# Altium project Rys_PCB.PrjPcb
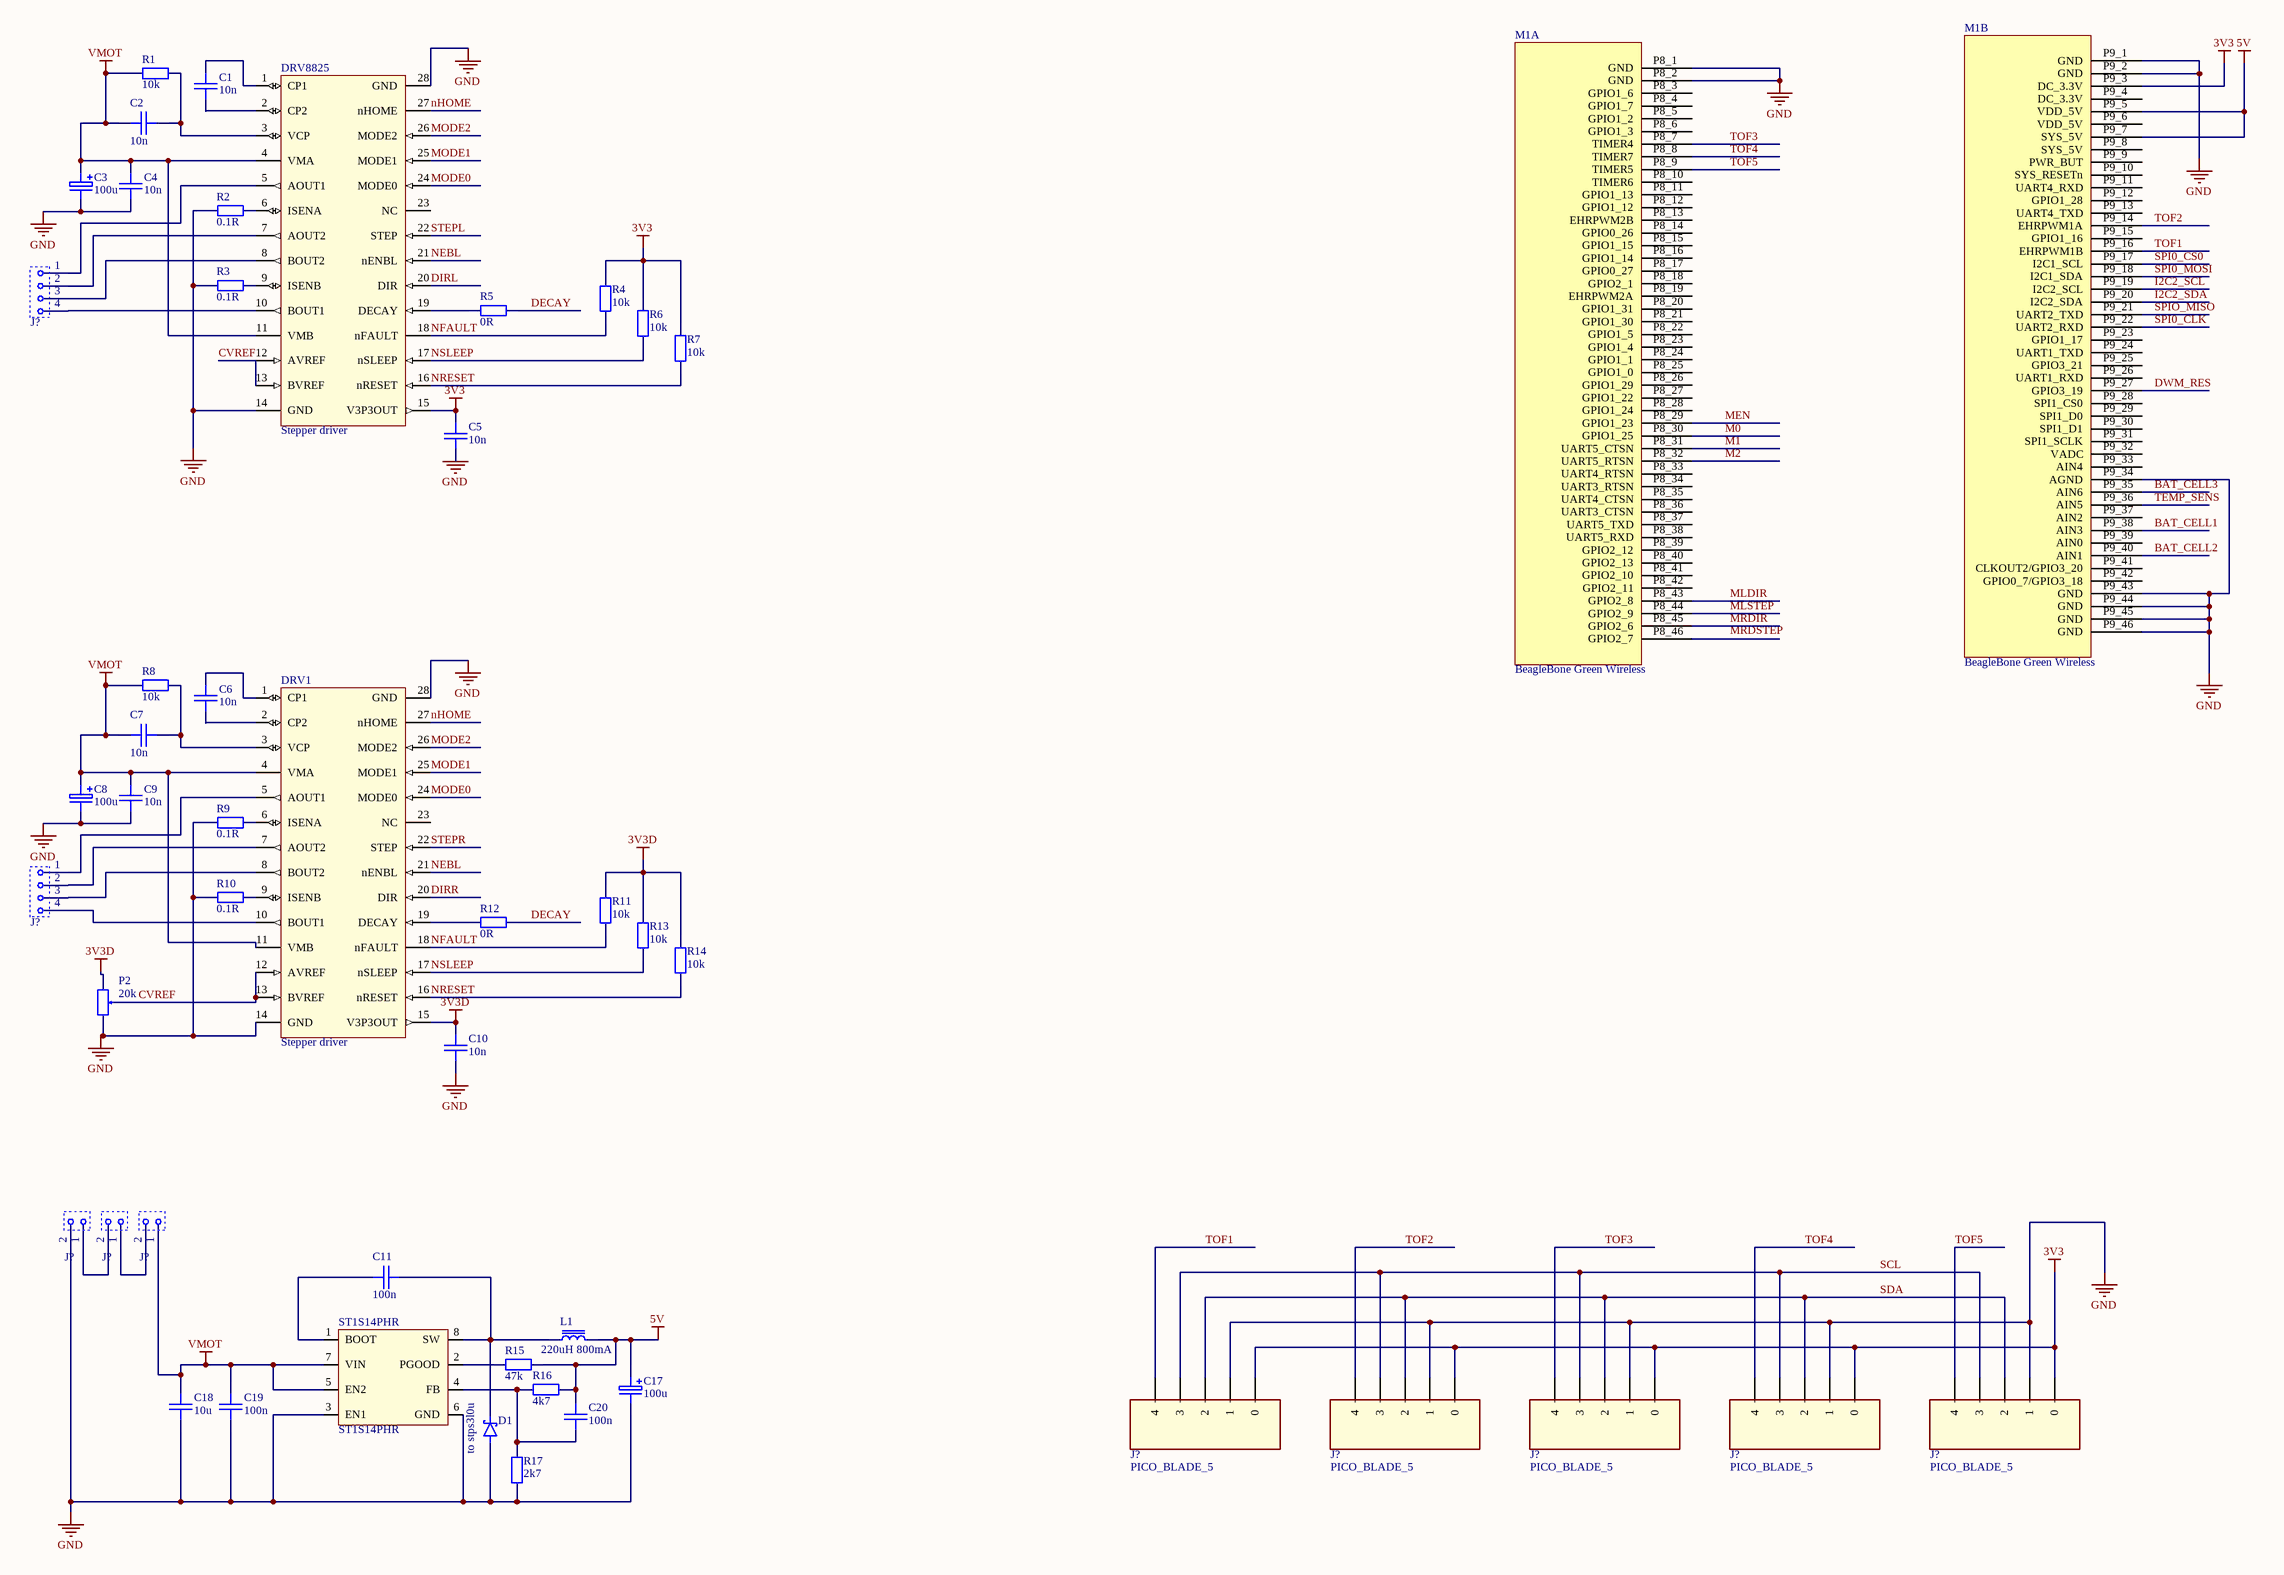
[diagram p0: rys_PCB.SchDoc]
1 sheet, 49 parts. Net scope: global (net labels, ports and power ports of the same name join across sheets).
Board file: rys_PCB.PcbDoc

## Sheet rys_PCB.SchDoc
size A2; Organization: Altium Limited; Address1: L3, 12a Rodborough Rd; Address2: Frenchs Forest; Address3: NSW; Address4: Australia 2086

### Parts
(Parts that share a designator on the sheet are numbered #1, #2 ... from top to bottom, then left to right.)
C1  10n  [0805]
C2  10n  [0805]
C3  100u  [_C_TAN_A]
C4  10n  [0805]
C5  10n  [0805]
C6  10n  [0805]
C7  10n  [0805]
C8  100u  [_C_TAN_A]
C9  10n  [0805]
C10  10n  [0805]
C11  100n  [0805]
C17  100u  [_C_TAN_A]
C18  10u  [0805]
C19  100n  [0805]
C20  100n  [0805]
D1  to stps3l0u  [SMB/DO-214AA]
DRV1  Stepper driver  [HTSSOP28]
DRV8825  Stepper driver  [HTSSOP28]
J?#1  Molex Microfit  [MICROFIT 4x1 Vertical]  (value not drawn)
J?#2  Molex Microfit  [MICROFIT 4x1 Vertical]  (value not drawn)
J?#3  Molex Microfit  [MICROFIT 1x2 Vertical]  (value not drawn)
J?#4  Molex Microfit  [MICROFIT 1x2 Vertical]  (value not drawn)
J?#5  Molex Microfit  [MICROFIT 1x2 Vertical]  (value not drawn)
J?#6  PICO_BLADE_5  [PicoBlade_THT_1x5_HEADER]
J?#7  PICO_BLADE_5  [PicoBlade_THT_1x5_HEADER]
J?#8  PICO_BLADE_5  [PicoBlade_THT_1x5_HEADER]
J?#9  PICO_BLADE_5  [PicoBlade_THT_1x5_HEADER]
J?#10  PICO_BLADE_5  [PicoBlade_THT_1x5_HEADER]
L1  220uH 800mA  [_L_DE1205]
M1  BeagleBone Green Wireless  [BeagleBone_Black]  (parts A,B of 2)
P2  20k  [_R_POTRM6H]
R1  10k  [0805_R]
R2  0.1R  [0805_R]
R3  0.1R  [0805_R]
R4  10k  [0805_R]
R5  0R  [0805_R]
R6  10k  [0805_R]
R7  10k  [0805_R]
R8  10k  [0805_R]
R9  0.1R  [0805_R]
R10  0.1R  [0805_R]
R11  10k  [0805_R]
R12  0R  [0805_R]
R13  10k  [0805_R]
R14  10k  [0805_R]
R15  47k  [0805_R]
R16  4k7  [0805_R]
R17  2k7  [0805_R]
ST1S14PHR  ST1S14PHR  [HSOP8]

### Nets
3V3: C5.1 DRV8825.15(V3P3OUT) J?#6.0 J?#7.0 J?#8.0 J?#9.0 J?#10.0 M1.P9_3(DC_3.3V) R4.2 R6.2 R7.2
3V3D: C10.1 DRV1.15(V3P3OUT) P2.3 R11.2 R13.2 R14.2
5V: C17.P C20.2 L1.1 M1.P9_5(VDD_5V) M1.P9_7(SYS_5V) R15.1 R16.1
GND: C3.N C4.2 C5.2 C8.N C9.2 C10.2 C17.N C18.1 C19.1 D1.A DRV1.14(GND) DRV1.28(GND) DRV8825.14(GND) DRV8825.28(GND) J?#3.2 J?#6.1 J?#7.1 J?#8.1 J?#9.1 J?#10.1 M1.P8_1(GND) M1.P8_2(GND) M1.P9_1(GND) M1.P9_2(GND) M1.P9_34(AGND) M1.P9_43(GND) M1.P9_44(GND) M1.P9_45(GND) M1.P9_46(GND) P2.1 R2.1 R3.1 R9.1 R10.1 R17.1 ST1S14PHR.3(EN1) ST1S14PHR.6(GND)
VMOT: C2.1 C3.P C4.1 C7.1 C8.P C9.1 C18.2 C19.2 DRV1.4(VMA) DRV1.11(VMB) DRV8825.4(VMA) DRV8825.11(VMB) J?#5.1 R1.1 R8.1 ST1S14PHR.5(EN2) ST1S14PHR.7(VIN)
BAT_CELL1: M1.P9_38(AIN3)
BAT_CELL2: M1.P9_40(AIN1)
BAT_CELL3: M1.P9_35(AIN6)
CVREF: DRV1.12(AVREF) DRV1.13(BVREF) DRV8825.12(AVREF) DRV8825.13(BVREF) P2.2
DECAY: R5.1 R12.1
DIRL: DRV8825.20(DIR)
DIRR: DRV1.20(DIR)
DWM_RES: M1.P9_27(GPIO3_19)
I2C2_SCL: M1.P9_19(I2C2_SCL)
I2C2_SDA: M1.P9_20(I2C2_SDA)
M0: M1.P8_30(GPIO1_25)
M1: M1.P8_31(UART5_CTSN)
M2: M1.P8_32(UART5_RTSN)
MEN: M1.P8_29(GPIO1_23)
MLDIR: M1.P8_43(GPIO2_8)
MLSTEP: M1.P8_44(GPIO2_9)
MODE0: DRV1.24(MODE0) DRV8825.24(MODE0)
MODE1: DRV1.25(MODE1) DRV8825.25(MODE1)
MODE2: DRV1.26(MODE2) DRV8825.26(MODE2)
MRDIR: M1.P8_45(GPIO2_6)
NEBL: DRV1.21(nENBL) DRV8825.21(nENBL)
NFAULT: DRV1.18(nFAULT) DRV8825.18(nFAULT) R4.1 R11.1
nHOME: DRV1.27(nHOME) DRV8825.27(nHOME)
NRESET: DRV1.16(nRESET) DRV8825.16(nRESET) R7.1 R14.1
NSLEEP: DRV1.17(nSLEEP) DRV8825.17(nSLEEP) R6.1 R13.1
SCL: J?#6.3 J?#7.3 J?#8.3 J?#9.3 J?#10.3
SDA: J?#6.2 J?#7.2 J?#8.2 J?#9.2 J?#10.2
SPI0_CLK: M1.P9_22(UART2_RXD)
SPI0_CS0: M1.P9_17(I2C1_SCL)
SPI0_MOSI: M1.P9_18(I2C1_SDA)
SPIO_MISO: M1.P9_21(UART2_TXD)
STEPL: DRV8825.22(STEP)
STEPR: DRV1.22(STEP)
TEMP_SENS: M1.P9_36(AIN5)
TOF1: J?#6.4 M1.P9_16(EHRPWM1B)
TOF2: J?#7.4 M1.P9_14(EHRPWM1A)
TOF3: J?#8.4 M1.P8_7(TIMER4)
TOF4: J?#9.4 M1.P8_8(TIMER7)
TOF5: J?#10.4 M1.P8_9(TIMER5)
NetC1_1: C1.1 DRV8825.1(CP1)
NetC1_2: C1.2 DRV8825.2(CP2)
NetC2_2: C2.2 DRV8825.3(VCP) R1.2
NetC6_1: C6.1 DRV1.1(CP1)
NetC6_2: C6.2 DRV1.2(CP2)
NetC7_2: C7.2 DRV1.3(VCP) R8.2
NetC11_1: C11.1 ST1S14PHR.1(BOOT)
NetC11_2: C11.2 D1.K L1.2 ST1S14PHR.8(SW)
NetC20_1: C20.1 R16.2 R17.2 ST1S14PHR.4(FB)
NetDRV1_5: DRV1.5(AOUT1) J?#2.1
NetDRV1_6: DRV1.6(ISENA) R9.2
NetDRV1_7: DRV1.7(AOUT2) J?#2.2
NetDRV1_8: DRV1.8(BOUT2) J?#2.3
NetDRV1_9: DRV1.9(ISENB) R10.2
NetDRV1_10: DRV1.10(BOUT1) J?#2.4
NetDRV1_19: DRV1.19(DECAY) R12.2
NetDRV8825_5: DRV8825.5(AOUT1) J?#1.1
NetDRV8825_6: DRV8825.6(ISENA) R2.2
NetDRV8825_7: DRV8825.7(AOUT2) J?#1.2
NetDRV8825_8: DRV8825.8(BOUT2) J?#1.3
NetDRV8825_9: DRV8825.9(ISENB) R3.2
NetDRV8825_10: DRV8825.10(BOUT1) J?#1.4
NetDRV8825_19: DRV8825.19(DECAY) R5.2
NetJ?#3_1: J?#3.1 J?#4.2
NetJ?#4_1: J?#4.1 J?#5.2
NetR15_2: R15.2 ST1S14PHR.2(PGOOD)

Not connected (* = marked no-connect by the designer): DRV1 23(NC); DRV8825 23(NC); M1 P8_3(GPIO1_6) P8_4(GPIO1_7) P8_5(GPIO1_2) P8_6(GPIO1_3) P8_10(TIMER6) P8_11(GPIO1_13) P8_12(GPIO1_12) P8_13(EHRPWM2B) P8_14(GPIO0_26) P8_15(GPIO1_15) P8_16(GPIO1_14) P8_17(GPIO0_27) P8_18(GPIO2_1) P8_19(EHRPWM2A) P8_20(GPIO1_31) P8_21(GPIO1_30) P8_22(GPIO1_5) P8_23(GPIO1_4) P8_24(GPIO1_1) P8_25(GPIO1_0) P8_26(GPIO1_29) P8_27(GPIO1_22) P8_28(GPIO1_24) P8_33(UART4_RTSN) P8_34(UART3_RTSN) P8_35(UART4_CTSN) P8_36(UART3_CTSN) P8_37(UART5_TXD) P8_38(UART5_RXD) P8_39(GPIO2_12) P8_40(GPIO2_13) P8_41(GPIO2_10) P8_42(GPIO2_11) P8_46(GPIO2_7) P9_4(DC_3.3V) P9_6(VDD_5V) P9_8(SYS_5V) P9_9(PWR_BUT) P9_10(SYS_RESETn) P9_11(UART4_RXD) P9_12(GPIO1_28) P9_13(UART4_TXD) P9_15(GPIO1_16) P9_23(GPIO1_17) P9_24(UART1_TXD) P9_25(GPIO3_21) P9_26(UART1_RXD) P9_28(SPI1_CS0) P9_29(SPI1_D0) P9_30(SPI1_D1) P9_31(SPI1_SCLK) P9_32(VADC) P9_33(AIN4) P9_37(AIN2) P9_39(AIN0) P9_41(CLKOUT2/GPIO3_20) P9_42(GPIO0_7/GPIO3_18)

### Notes on the sheet
- Labels drawn without touching a wire or pin: MRDSTEP
- Title
- Size:
- Date:
- A4
- Number:
- Time:
- Revision:
- Sheet
- of
- File:

### Library data of the parts
C1 C2 C4-C7 C9-C11 C18-C20 = C_CER: Ceramic Capacitor
C3 C8 C17 = C_TAN: Tantalum Capacitor
D1 = SK210: Schottky Diode 2A 100V; Supplier: TME; URL: http://www.tme.eu/pl/details/sk210/diody-schottky-smd/dc-components/#; Symbol: SK210
DRV1 DRV8825 = DRV8825: Supplier: Farnell; URL: http://pl.farnell.com/texas-instruments/drv8825pwpr/motor-driver-stepper-htssop-28/dp/2769196?st=drv8825; Supplier 1: Digi-Key
J?#1 J?#2 = Microfit 1x4: Symbol: Molex 436500429; Supplier: TME; URL: https://www.tme.eu/pl/details/mx-43650-0429/zlacza-sygnalowe-raster-300mm/molex/43650-0429/
J?#3-J?#5 = Microfit 2x1: Symbol: Molex 430450212; Supplier: TME
J?#6-J?#10 = PICO_BLADE_5: 1x5 header; URL: https://www.tme.eu/pl/details/mx-53047-0510/zlacza-sygnalowe-raster-125mm/molex/530470510/
L1 = L_IND_DE1205: Power Inductor 220uH 800mA; Supplier: TME; URL: http://www.tme.eu/pl/details/de1205-220/dlawiki-smd-mocy/ferrocore/#
M1 = Green Wireless: Supplier: Botland; Symbol: BeagleBone Green Wireless
P2 = P_POTRM6H: 3-Terminal Potentiometer; Symbol: POTRM6H; Supplier: Maritex, Piekarz(RM-s)
R1-R17 = R: Resistor
ST1S14PHR = ST1S14PHR: DC/DC converter 3A; Supplier: TME; URL: https://www.tme.eu/pl/details/st1s14phr/regulatory-napiecia-uklady-dcdc/st-microelectronics/